# Altium schematic sheet CAN_transceiver.SchDoc
size A4; Organization: Altium Limited; Address1: L3, 12a Rodborough Rd; Address2: Frenchs Forest; Address3: NSW; Address4: Australia 2086; DocumentNumber: 13; SheetNumber: 13; SheetTotal: 19
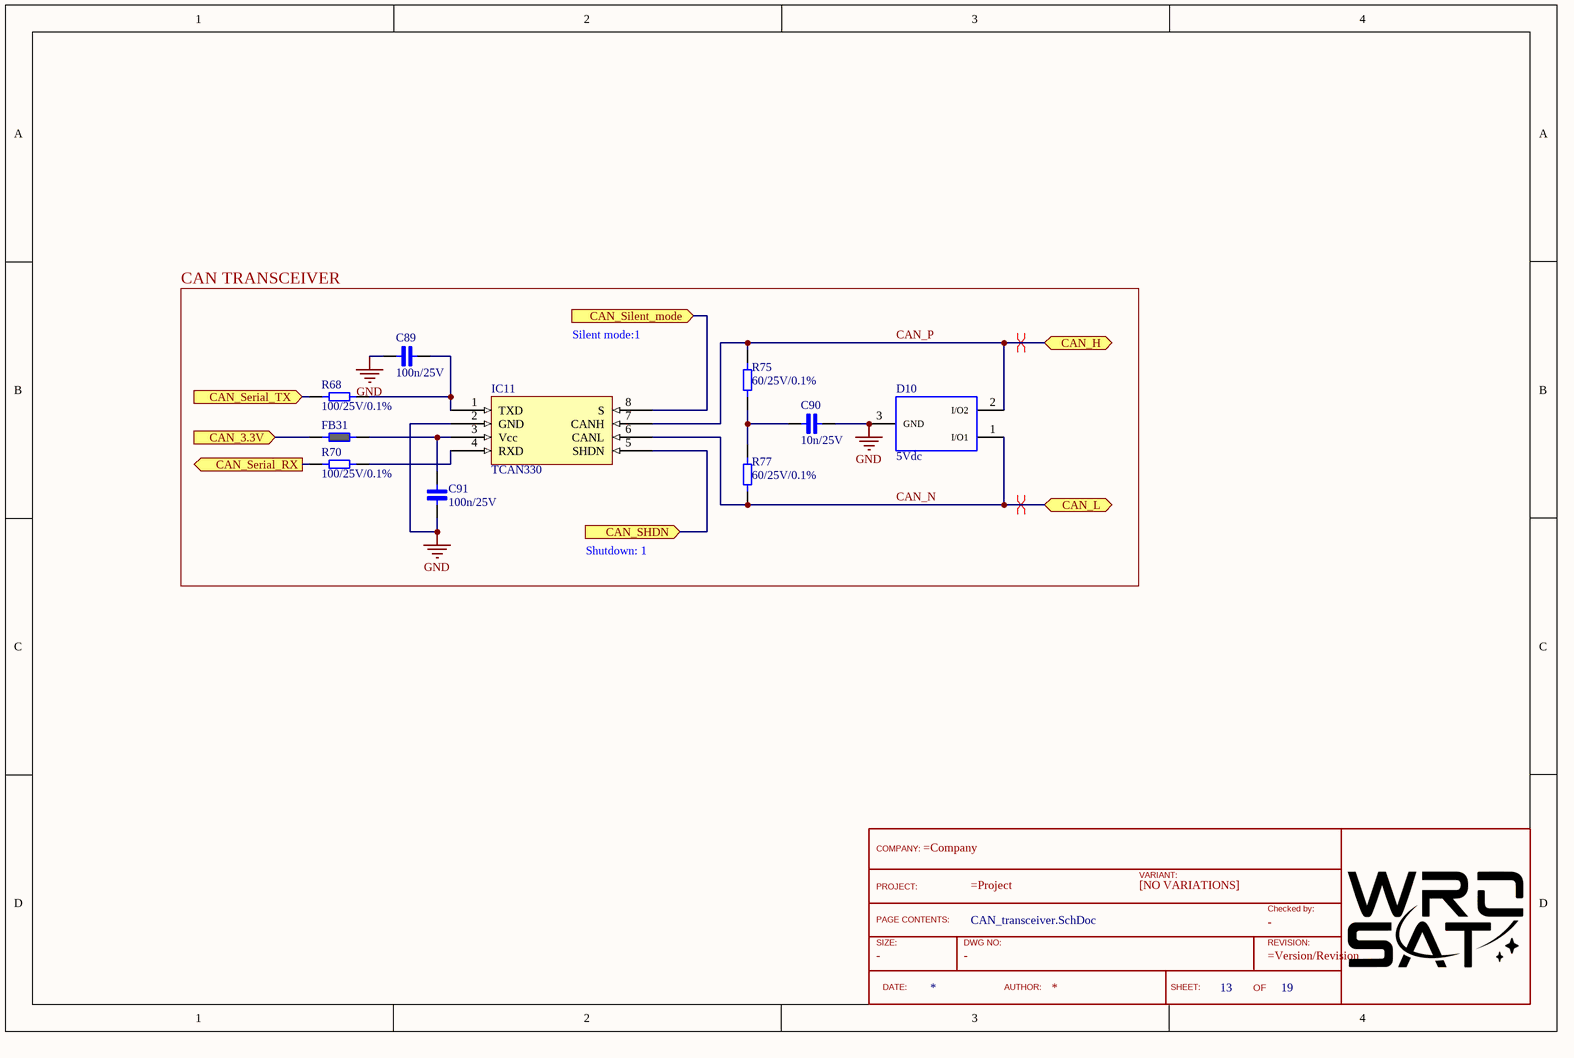
[diagram p0: CAN_transceiver.SchDoc]

## Parts
?  TitleBlock  (value not drawn)  (graphical)
C89  100n/25V  [Cap_0402]
C90  10n/25V  [Cap_0402]
C91  100n/25V  [Cap_0402]
D10  5Vdc  [WE-TVS_SOT23-3L]
FB31  Ferrite_bead_0402  [FERRITE_0402]  (value not drawn)
IC11  TCAN330  [SOIC8]
R68  100/25V/0.1%  [RES_0402]
R70  100/25V/0.1%  [RES_0402]
R75  60/25V/0.1%  [RES_1206]
R77  60/25V/0.1%  [RES_1206]

## Blocks framed on the sheet
CAN TRANSCEIVER: C89-C91 D10 FB31 IC11 R68 R70 R75 R77

## Ports
CAN_3.3V (in), CAN_H (bidir), CAN_L (bidir), CAN_Serial_RX (out), CAN_Serial_TX (in), CAN_SHDN (in), CAN_Silent_mode (in)

## Nets
GND: C89.1 C90.2 C91.1 D10.3(GND) IC11.2(GND)
CAN_3.3V: FB31.1 ; port CAN_3.3V
CAN_N: D10.1(I/O1) IC11.6(CANL) R77.1 ; port CAN_L
CAN_P: D10.2(I/O2) IC11.7(CANH) R75.2 ; port CAN_H
CAN_Serial_RX: R70.1 ; port CAN_Serial_RX
CAN_Serial_TX: R68.1 ; port CAN_Serial_TX
CAN_SHDN: IC11.5(SHDN) ; port CAN_SHDN
CAN_Silent_mode: IC11.8(S) ; port CAN_Silent_mode
NetC89_2: C89.2 IC11.1(TXD) R68.2
NetC90_1: C90.1 R75.1 R77.2
NetC91_2: C91.2 FB31.2 IC11.3(Vcc)
NetIC11_4: IC11.4(RXD) R70.2

## Layout directives
differential pair: CAN_N, CAN_P

## Notes on the sheet
- Silent mode:1
- Shutdown: 1
- Title
- Size:
- Date:
- A3
- Number:
- Time:
- Revision:
- Sheet
- of
- File:
- (in symbol TitleBlock) COMPANY:; VARIANT:; PROJECT:; [NO VARIATIONS]; Checked by:; PAGE CONTENTS:; SIZE:; DWG NO:; REVISION:; DATE:; AUTHOR:; SHEET:; OF

## Library data of the parts
? = TitleBlock: Standard TitleBlock; DrawingNo: -; Size: -; Checked: -
C89 C91 = Cap_0402_100n: Ceramic Capacitor 100n / 0402 / 25V / ±5%, Wurth Elektronik MLCC; ComponentLink1Description: New link; ComponentLink1URL: https://www.we-online.com/catalog/en/WCAP-CSGP-25VDC
C90 = Cap_0402_10n: Ceramic Capacitor 10n / 0402 / 25V / ±5%, Wurth Elektronik MLCC; ComponentLink1Description: New link; ComponentLink1URL: https://www.we-online.com/catalog/en/WCAP-CSGP-25VDC
D10 = 824022: WE-TVS TVS Diode - Standard Series, SOT23-3L, 2Channel, 5Vdc; Manufacturer: Wurth Elektronik; Reverse Breakdown Voltage min.: 6.1V; Channel: 2; Channel Input Capacitance: 12pF; Reverse Peak Pulse Current: 8A; Reverse Channel Leakage Current: 2.5uA; DC Operating Voltage: 5V; ComponentLink1Description: Manufacturer; ComponentLink1URL: http://www.we-online.de; ComponentLink2Description: Datasheet; ComponentLink2URL: https://www.we-online.com/catalog/datasheet/824022.pdf; Manufacturer Part Number: 824022; Published Date: April 2020; Size: SOT23-3L; Operating Temperature: -55 to +125degC; Mounting Technology: SMT; Packaging: Tape and Reel
FB31 = Ferrite_bead_0402: Ferrite bead, wurth 74269241102
IC11 = TCAN330: CAN transceiver, 3,3V
R68 R70 = Res_0402_100: Vishay, thin film resistor 100/25V/0.1%
R75 R77 = Res_1206_60: Vishay, thin film resistor 60/25V/0.1%